# EAGLE schematic bender (EAGLE 8.2.2)
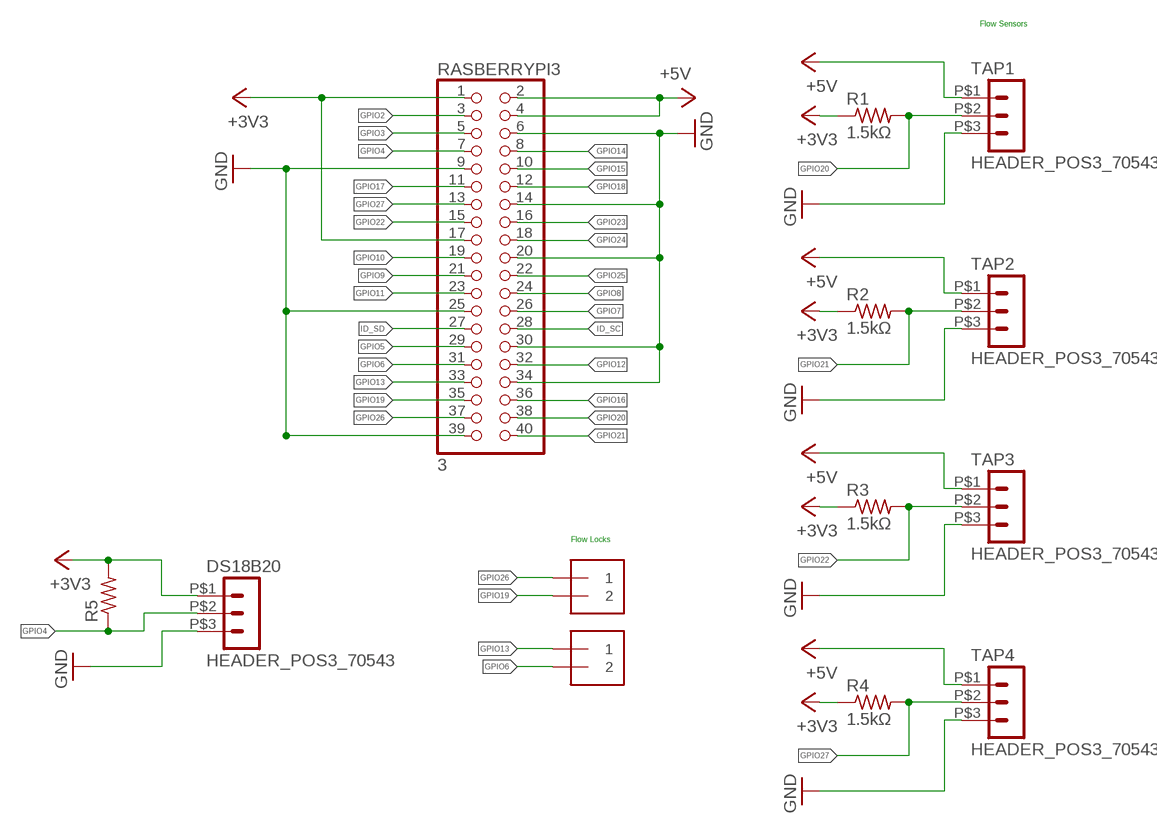
[diagram p0: schematic, sheet 1]

## Parts
DS18B20  HEADER_POS3_70543  [70543-POS3]
LOCK12  1X2-3.5MM  [1X2-3.5MM]
LOCK34  1X2-3.5MM  [1X2-3.5MM]
R1  1.5kΩ  R-US_0204/7  [0204/7]
R2  1.5kΩ  R-US_0204/7  [0204/7]
R3  1.5kΩ  R-US_0204/7  [0204/7]
R4  1.5kΩ  R-US_0204/7  [0204/7]
R5  R-US_0204/7  [0204/7]
RASBERRYPI3  3  PINHD-2X20  [2X20]
TAP1  HEADER_POS3_70543  [70543-POS3]
TAP2  HEADER_POS3_70543  [70543-POS3]
TAP3  HEADER_POS3_70543  [70543-POS3]
TAP4  HEADER_POS3_70543  [70543-POS3]

## Nets
+3V3: DS18B20.P$1 R1.1 R2.1 R3.1 R4.1 R5.2 RASBERRYPI3.1(3.3V) RASBERRYPI3.17
+5V: RASBERRYPI3.2 RASBERRYPI3.4 TAP1.P$1 TAP2.P$1 TAP3.P$1 TAP4.P$1
GND: DS18B20.P$3 RASBERRYPI3.6 RASBERRYPI3.9(GND) RASBERRYPI3.14 RASBERRYPI3.20 RASBERRYPI3.25 RASBERRYPI3.30 RASBERRYPI3.34 RASBERRYPI3.39 TAP1.P$3 TAP2.P$3 TAP3.P$3 TAP4.P$3
GPIO2: RASBERRYPI3.3(GPIO2)
GPIO3: RASBERRYPI3.5(GPIO3)
GPIO4: DS18B20.P$2 R5.1 RASBERRYPI3.7(GPIO4)
GPIO5: RASBERRYPI3.29
GPIO6: LOCK34.2 RASBERRYPI3.31
GPIO7: RASBERRYPI3.26
GPIO8: RASBERRYPI3.24
GPIO9: RASBERRYPI3.21
GPIO10: RASBERRYPI3.19
GPIO11: RASBERRYPI3.23
GPIO12: RASBERRYPI3.32
GPIO13: LOCK34.1 RASBERRYPI3.33
GPIO14: RASBERRYPI3.8
GPIO15: RASBERRYPI3.10
GPIO16: RASBERRYPI3.36
GPIO17: RASBERRYPI3.11(GPIO17)
GPIO18: RASBERRYPI3.12
GPIO19: LOCK12.2 RASBERRYPI3.35
GPIO20: R1.2 RASBERRYPI3.38 TAP1.P$2
GPIO21: R2.2 RASBERRYPI3.40 TAP2.P$2
GPIO22: R3.2 RASBERRYPI3.15(GPIO22) TAP3.P$2
GPIO23: RASBERRYPI3.16
GPIO24: RASBERRYPI3.18
GPIO25: RASBERRYPI3.22
GPIO26: LOCK12.1 RASBERRYPI3.37
GPIO27: R4.2 RASBERRYPI3.13(GPIO27) TAP4.P$2
ID_SC: RASBERRYPI3.28
ID_SD: RASBERRYPI3.27

## Notes on the sheet
- Flow Sensors
- Flow Locks

## Library data of the parts
DS18B20 TAP1-TAP4 = con-molex-c-grid-sl:HEADER_POS3_?: Molex -C-Grid® / SL Series connector Wire-to-Board 2.54 mm (0.100") pitch header, 3 positions.
LOCK12 LOCK34 = adafruit:1X2: 3.5mm Terminal block http://www.ladyada.net/library/pcb/eaglelibrary.html
R1-R5 = adafruit:R-US_: RESISTOR, American symbol
RASBERRYPI3 = adafruit:PINHD-2X20: PIN HEADER